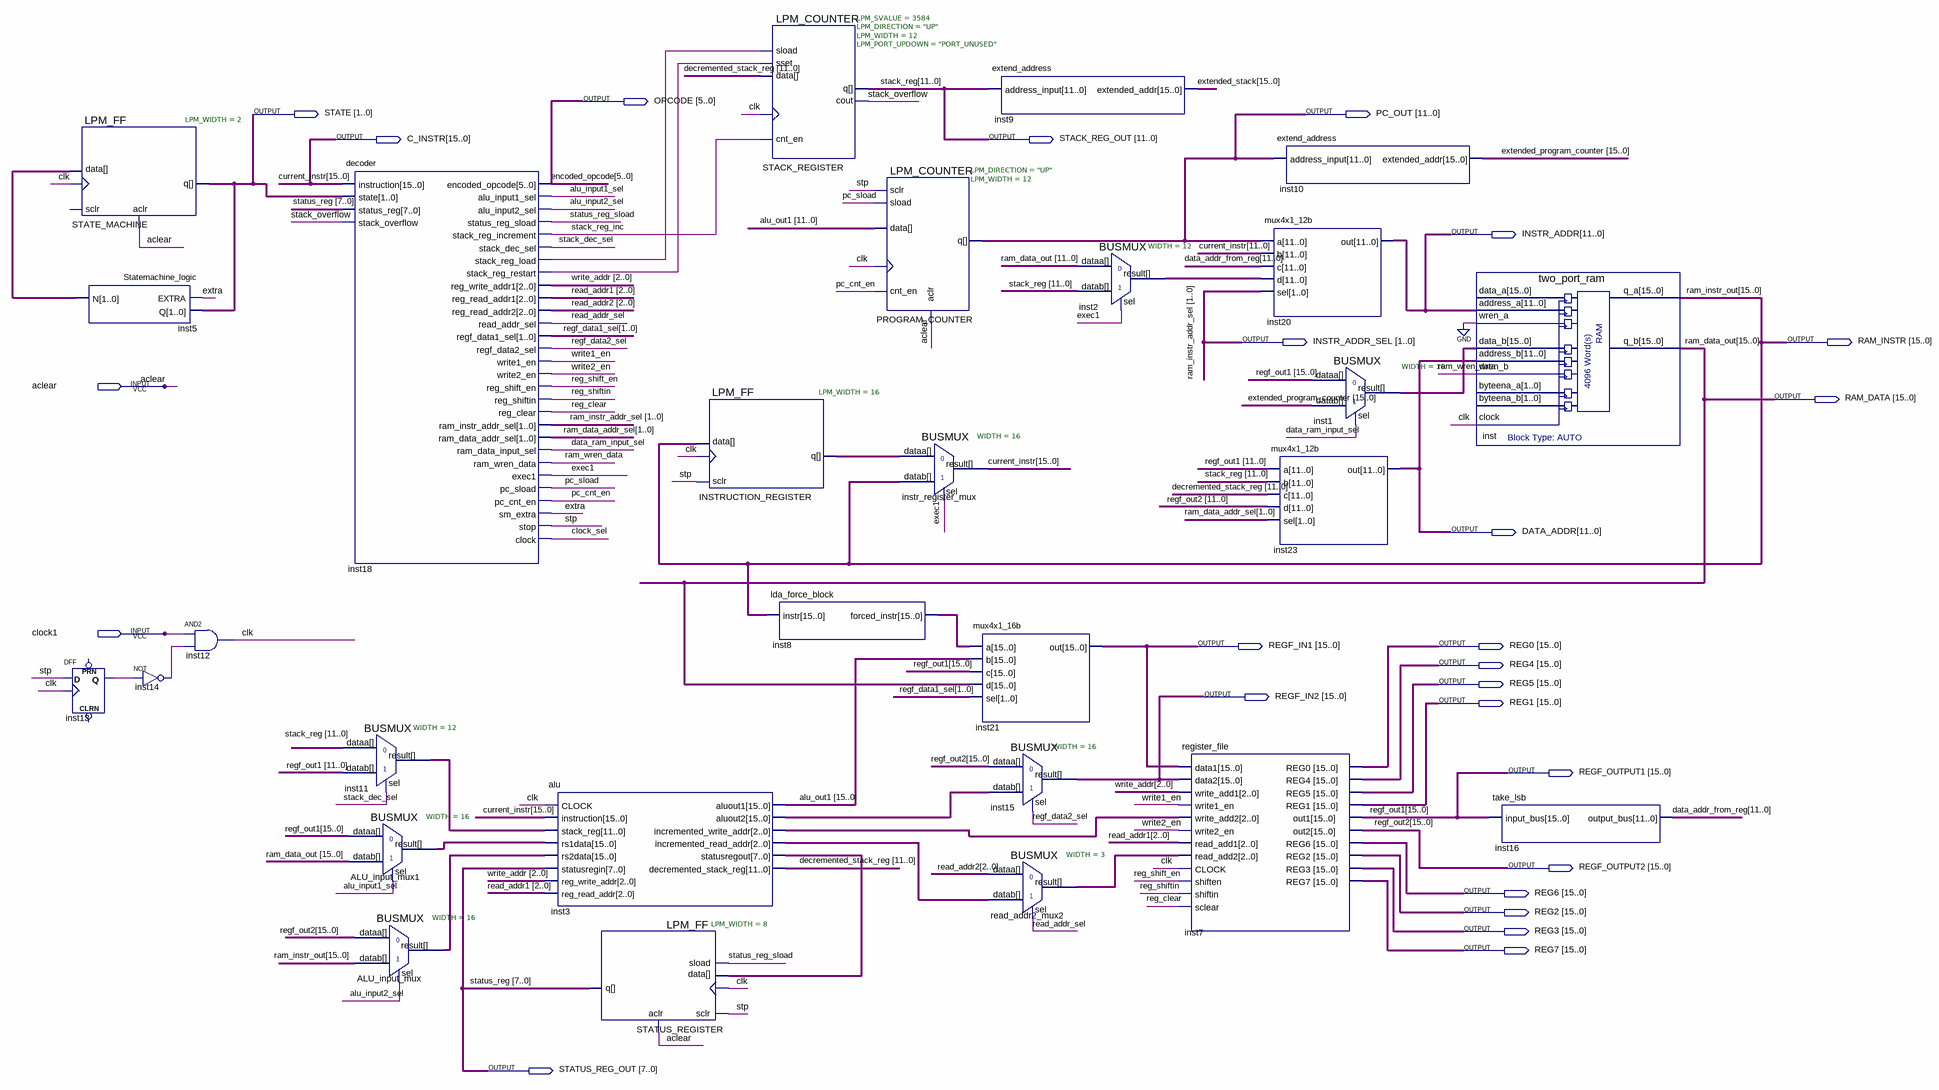
[diagram p0: schematic sheet]
// Quartus schematic Evermoore.bdf as structural Verilog: 28 symbols, 25 pins
module Evermoore (
  input  aclear,
  input  clock1,
  output [5:0] OPCODE,
  output [1:0] STATE,
  output [11:0] PC_OUT,
  output [15:0] C_INSTR,
  output [11:0] STACK_REG_OUT,
  output [11:0] INSTR_ADDR,
  output [1:0] INSTR_ADDR_SEL,
  output [15:0] RAM_INSTR,
  output [15:0] RAM_DATA,
  output [11:0] DATA_ADDR,
  output [15:0] REGF_IN1,
  output [15:0] REG0,
  output [15:0] REG4,
  output [15:0] REG5,
  output [15:0] REGF_IN2,
  output [15:0] REG1,
  output [15:0] REGF_OUTPUT1,
  output [15:0] REGF_OUTPUT2,
  output [15:0] REG6,
  output [15:0] REG2,
  output [15:0] REG3,
  output [15:0] REG7,
  output [7:0] STATUS_REG_OUT
);

  wire alu_input1_sel, alu_input2_sel, clk, clock_sel, data_ram_input_sel, exec1, extra, inst13_q,
       inst14_out, inst18_stack_reg_load, inst18_stack_reg_restart, pc_cnt_en, pc_sload, ram_wren_data,
       read_addr_sel, reg_clear, reg_shift_en, reg_shiftin, regf_data2_sel, stack_dec_sel, stack_overflow,
       stack_reg_inc, status_reg_sload, stp, write1_en, write2_en;
  wire [1:0] inst5_n, ram_data_addr_sel, regf_data1_sel;
  wire [2:0] inst3_incremented_read_addr, inst3_incremented_write_addr, read_addr1, read_addr2,
       read_addr2_mux2_result, write_addr;
  wire [7:0] inst3_statusregout;
  wire [11:0] data_addr_from_reg, decremented_stack_reg, inst2_result, inst11_result;
  wire [15:0] ALU_input_mux1_result, ALU_input_mux_result, alu_out1, extended_program_counter,
       extended_stack, inst1_result, inst3_aluout2, inst8_forced_instr, INSTRUCTION_REGISTER_q;

  LPM_FF #(.LPM_WIDTH(2)) STATE_MACHINE (.clock(clk), .aclr(aclear), .data(inst5_n), .q(STATE));  // open: sclr
  Statemachine_logic inst5 (.EXTRA(extra), .Q(STATE), .N(inst5_n));
  DFF inst13 (.CLK(clk), .D(stp), .Q(inst13_q));  // open: CLRN, PRN
  not inst14 (inst14_out, inst13_q);
  and inst12 (clk, clock1, inst14_out);
  decoder inst18 (
    .instruction(C_INSTR), .state(STATE), .status_reg(STATUS_REG_OUT), .stack_overflow(stack_overflow),
    .encoded_opcode(OPCODE), .alu_input1_sel(alu_input1_sel), .alu_input2_sel(alu_input2_sel),
    .status_reg_sload(status_reg_sload), .stack_reg_increment(stack_reg_inc), .stack_dec_sel(stack_dec_sel),
    .stack_reg_load(inst18_stack_reg_load), .stack_reg_restart(inst18_stack_reg_restart),
    .reg_write_addr1(write_addr), .reg_read_addr1(read_addr1), .reg_read_addr2(read_addr2),
    .read_addr_sel(read_addr_sel), .regf_data1_sel(regf_data1_sel), .regf_data2_sel(regf_data2_sel),
    .write1_en(write1_en), .write2_en(write2_en), .reg_shift_en(reg_shift_en), .reg_shiftin(reg_shiftin),
    .reg_clear(reg_clear), .ram_instr_addr_sel(INSTR_ADDR_SEL), .ram_data_addr_sel(ram_data_addr_sel),
    .ram_data_input_sel(data_ram_input_sel), .ram_wren_data(ram_wren_data), .exec1(exec1),
    .pc_sload(pc_sload), .pc_cnt_en(pc_cnt_en), .sm_extra(extra), .stop(stp), .clock(clock_sel));
  BUSMUX #(.WIDTH(12)) inst11 (
    .datab(REGF_OUTPUT1[11:0]), .sel(stack_dec_sel), .dataa(STACK_REG_OUT), .result(inst11_result));
  BUSMUX #(.WIDTH(16)) ALU_input_mux1 (
    .datab(RAM_DATA), .sel(alu_input1_sel), .dataa(REGF_OUTPUT1), .result(ALU_input_mux1_result));
  BUSMUX #(.WIDTH(16)) ALU_input_mux (
    .datab(RAM_INSTR), .sel(alu_input2_sel), .dataa(REGF_OUTPUT2), .result(ALU_input_mux_result));
  alu inst3 (
    .CLOCK(clk), .instruction(C_INSTR), .stack_reg(inst11_result), .rs1data(ALU_input_mux1_result),
    .rs2data(ALU_input_mux_result), .statusregin(STATUS_REG_OUT), .reg_write_addr(write_addr),
    .reg_read_addr(read_addr1), .aluout1(alu_out1), .aluout2(inst3_aluout2),
    .incremented_write_addr(inst3_incremented_write_addr),
    .incremented_read_addr(inst3_incremented_read_addr), .statusregout(inst3_statusregout),
    .decremented_stack_reg(decremented_stack_reg));
  LPM_FF #(.LPM_WIDTH(8)) STATUS_REGISTER (
    .clock(clk), .sload(status_reg_sload), .sclr(stp), .aclr(aclear), .data(inst3_statusregout),
    .q(STATUS_REG_OUT));
  LPM_FF #(.LPM_WIDTH(16)) INSTRUCTION_REGISTER (.clock(clk), .sclr(stp), .data(RAM_INSTR), .q(INSTRUCTION_REGISTER_q));
  LPM_COUNTER #(.LPM_SVALUE(3584), .LPM_DIRECTION("UP"), .LPM_WIDTH(12), .LPM_PORT_UPDOWN("PORT_UNUSED")) STACK_REGISTER (
    .sload(inst18_stack_reg_load), .data(decremented_stack_reg), .clock(clk),
    .sset(inst18_stack_reg_restart), .cnt_en(stack_reg_inc), .q(STACK_REG_OUT), .cout(stack_overflow));
  lda_force_block inst8 (.instr(RAM_INSTR), .forced_instr(inst8_forced_instr));
  LPM_COUNTER #(.LPM_DIRECTION("UP"), .LPM_WIDTH(12)) PROGRAM_COUNTER (
    .sload(pc_sload), .data(alu_out1[11:0]), .clock(clk), .aclr(aclear), .cnt_en(pc_cnt_en), .sclr(stp),
    .q(PC_OUT));
  BUSMUX #(.WIDTH(16)) instr_register_mux (
    .datab(RAM_INSTR), .sel(exec1), .dataa(INSTRUCTION_REGISTER_q), .result(C_INSTR));
  extend_address inst9 (.address_input(STACK_REG_OUT), .extended_addr(extended_stack));
  mux4x1_16b inst21 (
    .a(inst8_forced_instr), .b(alu_out1), .c(REGF_OUTPUT1), .d(RAM_DATA), .sel(regf_data1_sel), .out(REGF_IN1));
  BUSMUX #(.WIDTH(16)) inst15 (.datab(inst3_aluout2), .sel(regf_data2_sel), .dataa(REGF_OUTPUT2), .result(REGF_IN2));
  BUSMUX #(.WIDTH(3)) read_addr2_mux2 (
    .datab(inst3_incremented_read_addr), .sel(read_addr_sel), .dataa(read_addr2),
    .result(read_addr2_mux2_result));
  BUSMUX #(.WIDTH(12)) inst2 (.datab(STACK_REG_OUT), .sel(exec1), .dataa(RAM_DATA[11:0]), .result(inst2_result));
  register_file inst7 (
    .data1(REGF_IN1), .data2(REGF_IN2), .write_add1(write_addr), .write1_en(write1_en),
    .write_add2(inst3_incremented_write_addr), .write2_en(write2_en), .read_add1(read_addr1),
    .read_add2(read_addr2_mux2_result), .CLOCK(clk), .shiften(reg_shift_en), .shiftin(reg_shiftin),
    .sclear(reg_clear), .REG0(REG0), .REG4(REG4), .REG5(REG5), .REG1(REG1), .out1(REGF_OUTPUT1),
    .out2(REGF_OUTPUT2), .REG6(REG6), .REG2(REG2), .REG3(REG3), .REG7(REG7));
  mux4x1_12b inst20 (
    .a(PC_OUT), .b(C_INSTR[11:0]), .c(data_addr_from_reg), .d(inst2_result), .sel(INSTR_ADDR_SEL),
    .out(INSTR_ADDR));
  extend_address inst10 (.address_input(PC_OUT), .extended_addr(extended_program_counter));
  BUSMUX #(.WIDTH(16)) inst1 (
    .datab(extended_program_counter), .sel(data_ram_input_sel), .dataa(REGF_OUTPUT1), .result(inst1_result));
  mux4x1_12b inst23 (
    .a(REGF_OUTPUT1[11:0]), .b(STACK_REG_OUT), .c(decremented_stack_reg), .d(REGF_OUTPUT2[11:0]),
    .sel(ram_data_addr_sel), .out(DATA_ADDR));
  two_port_ram inst (
    .address_a(INSTR_ADDR), .wren_a(1'b0), .data_b(inst1_result), .address_b(DATA_ADDR),
    .wren_b(ram_wren_data), .clock(clk), .q_a(RAM_INSTR), .q_b(RAM_DATA));  // open: data_a, byteena_a, byteena_b
  take_lsb inst16 (.input_bus(REGF_OUTPUT1), .output_bus(data_addr_from_reg));

  // Other names for the same wires on the sheet: current_instr[15:0] = C_INSTR; encoded_opcode[5:0] = OPCODE;
  //   ram_data_out[15:0] = RAM_DATA; ram_instr_out[15:0] = RAM_INSTR; ram_instr_addr_sel[1:0] = INSTR_ADDR_SEL;
  //   regf_out1[15:0] = REGF_OUTPUT1; regf_out2[15:0] = REGF_OUTPUT2; stack_reg[11:0] = STACK_REG_OUT;
  //   status_reg[7:0] = STATUS_REG_OUT
endmodule
